# EAGLE design LMH6881-Breakout(Single_Layer) (EAGLE 7.7.0)
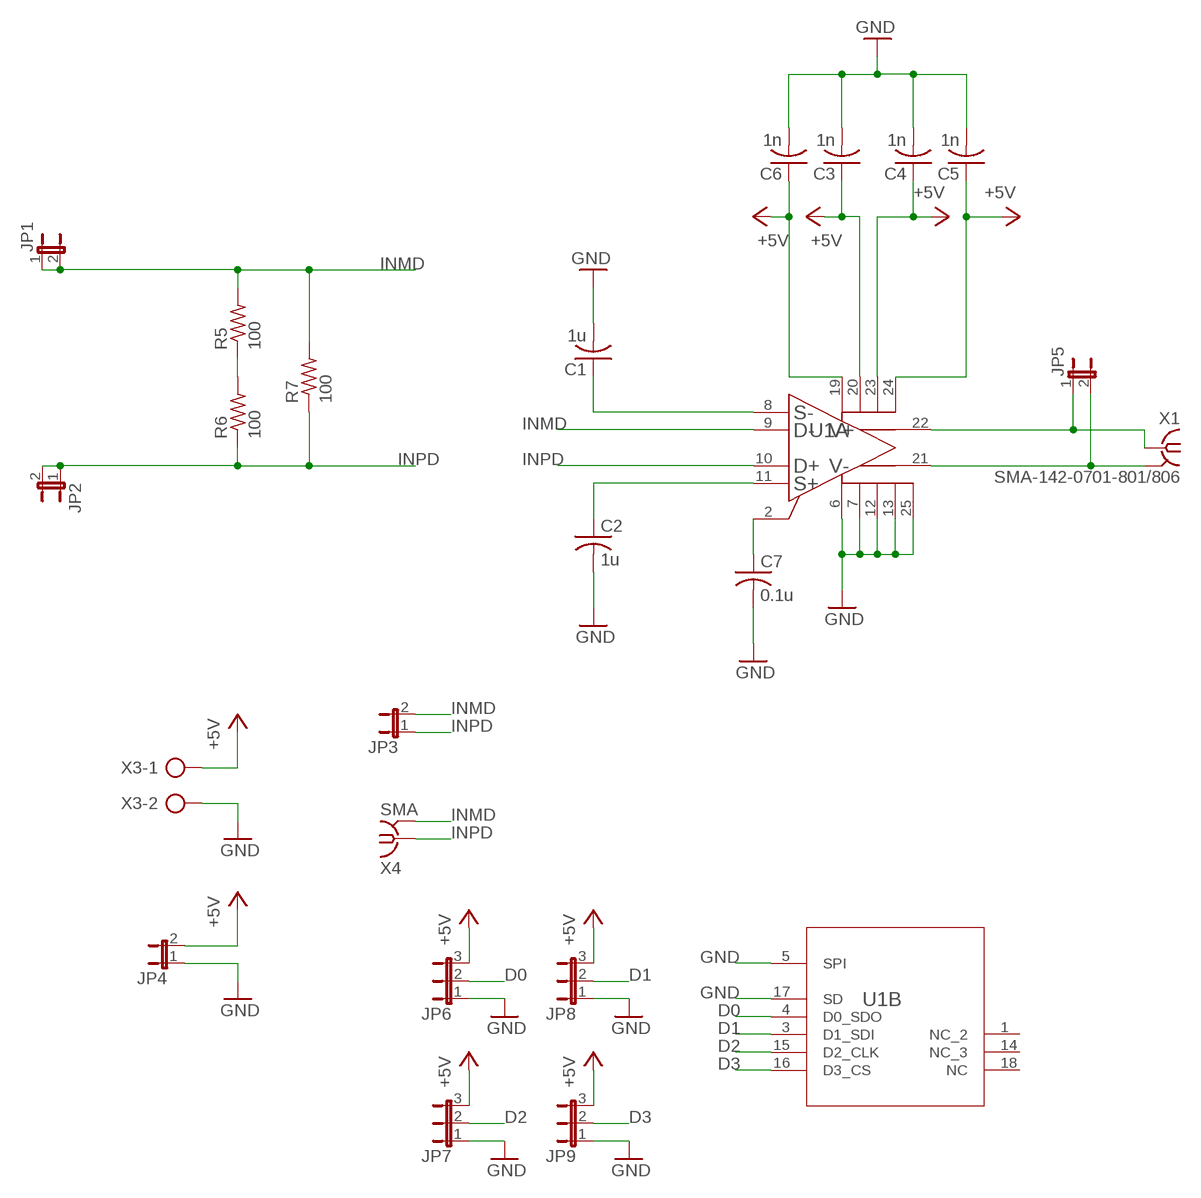
[diagram p0: schematic, sheet 1]

## Parts
C1  1u  C-USC0805  [C0805]
C2  1u  C-USC0805  [C0805]
C3  1n  C-USC0805  [C0805]
C4  1n  C-USC0805  [C0805]
C5  1n  C-USC0805  [C0805]
C6  1n  C-USC0805  [C0805]
C7  0.1u  C-USC0805  [C0805]
JP1  JP1E  [JP1]
JP2  JP1E  [JP1]
JP3  JP1E  [JP1]
JP4  JP1E  [JP1]
JP5  JP1E  [JP1]
JP6  JP2E  [JP2]
JP7  JP2E  [JP2]
JP8  JP2E  [JP2]
JP9  JP2E  [JP2]
R5  100  R-US_R0805  [R0805]
R6  100  R-US_R0805  [R0805]
R7  100  R-US_R0805  [R0805]
U1  LMH6881SQX/NOPB  [RTW0024A]
X1  SMA-142-0701-801/806  [J502-ND-142-0701-801/806]
X3  AK500/2  [AK500/2]
X4  SMA  SMA-142-0701-801/806  [J502-ND-142-0701-801/806]

## Nets
+5V: C3.1 C4.1 C5.1 C6.1 JP4.2 JP6.3 JP7.3 JP8.3 JP9.3 U1.19(A:VCC_2) U1.20(A:VCC_3) U1.23(A:VCC_4) U1.24(A:VCC) X3.1
D0: JP6.2 U1.4(B:D0_SDO)
D1: JP8.2 U1.3(B:D1_SDI)
D2: JP7.2 U1.15(B:D2_CLK)
D3: JP9.2 U1.16(B:D3_CS)
GND: C1.2 C2.2 C3.2 C4.2 C5.2 C6.2 C7.2 JP4.1 JP6.1 JP7.1 JP8.1 JP9.1 U1.5(B:SPI) U1.6(A:GND_2) U1.7(A:GND_3) U1.12(A:GND_4) U1.13(A:GND) U1.17(B:SD) U1.25(A:PAD) X3.2
INMD: JP1.1 JP1.2 JP3.2 R5.2 R7.2 U1.9(A:INMD) X4.G@1 X4.G@2 X4.G@3 X4.G@4
INPD: JP2.1 JP2.2 JP3.1 R6.1 R7.1 U1.10(A:INPD) X4.1
N$1: C7.1 U1.2(A:OCM)
N$3: C1.1 U1.8(A:INMS)
N$4: C2.1 U1.11(A:INPS)
N$5: JP5.1 U1.22(A:OUTP) X1.1
N$6: JP5.2 U1.21(A:OUTM) X1.G@1 X1.G@2 X1.G@3 X1.G@4
N$7: R5.1 R6.2
Unconnected: U1.1(B:NC_2) U1.14(B:NC_3) U1.18(B:NC)

## Library data of the parts
C1-C7 = resistor:C-US: CAPACITOR, American symbol
JP1-JP5 = jumper:JP1E: JUMPER
JP6-JP9 = jumper:JP2E: JUMPER
R5-R7 = resistor:R-US_: RESISTOR, American symbol
U1 = LMH6881:LMH6881SQX/NOPB; ALTERNATEPARTNUMBER: LMH6881SQNOPB; APPLICATION_BUILDNUMBER: *; COMPTYPE: IC; MANUFACTURER: Texas Instruments; MOUNTTYPE: SMT; PACKAGEREFERENCE: RTW0024A; PARTNUMBER: LMH6881SQXNOPB; PIN_COUNT: 25; REFDES: RefDes; ROHS: Y; TYPE: TYPE; VALUE: Value
X1 X4 = con-coax:SMA-: SMA 50 Ohm End Launch Jack Receptacle - Round Contact Johnson Components Source: www.johnsoncomponents.com .. J502-ND.pdf; MF: JOHNSON COMPONENTS; MPN: 142-0701-801; OC_FARNELL: 1608592; OC_NEWARK: 90F2624
X3 = con-ptr500:AK500/2: CONNECTOR; OC_FARNELL: unknown; OC_NEWARK: unknown

## Board
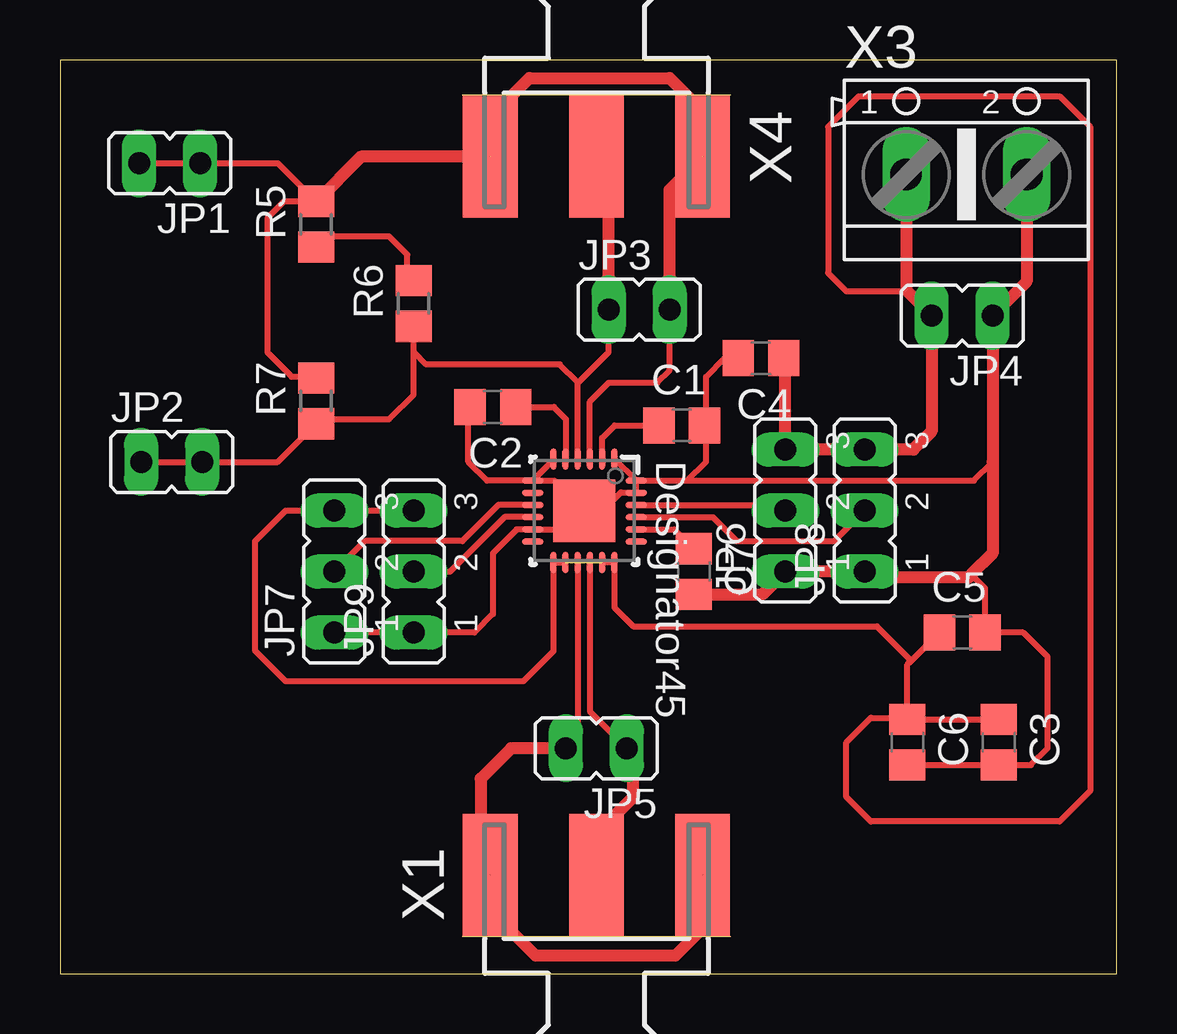
[diagram p1: board, top side]
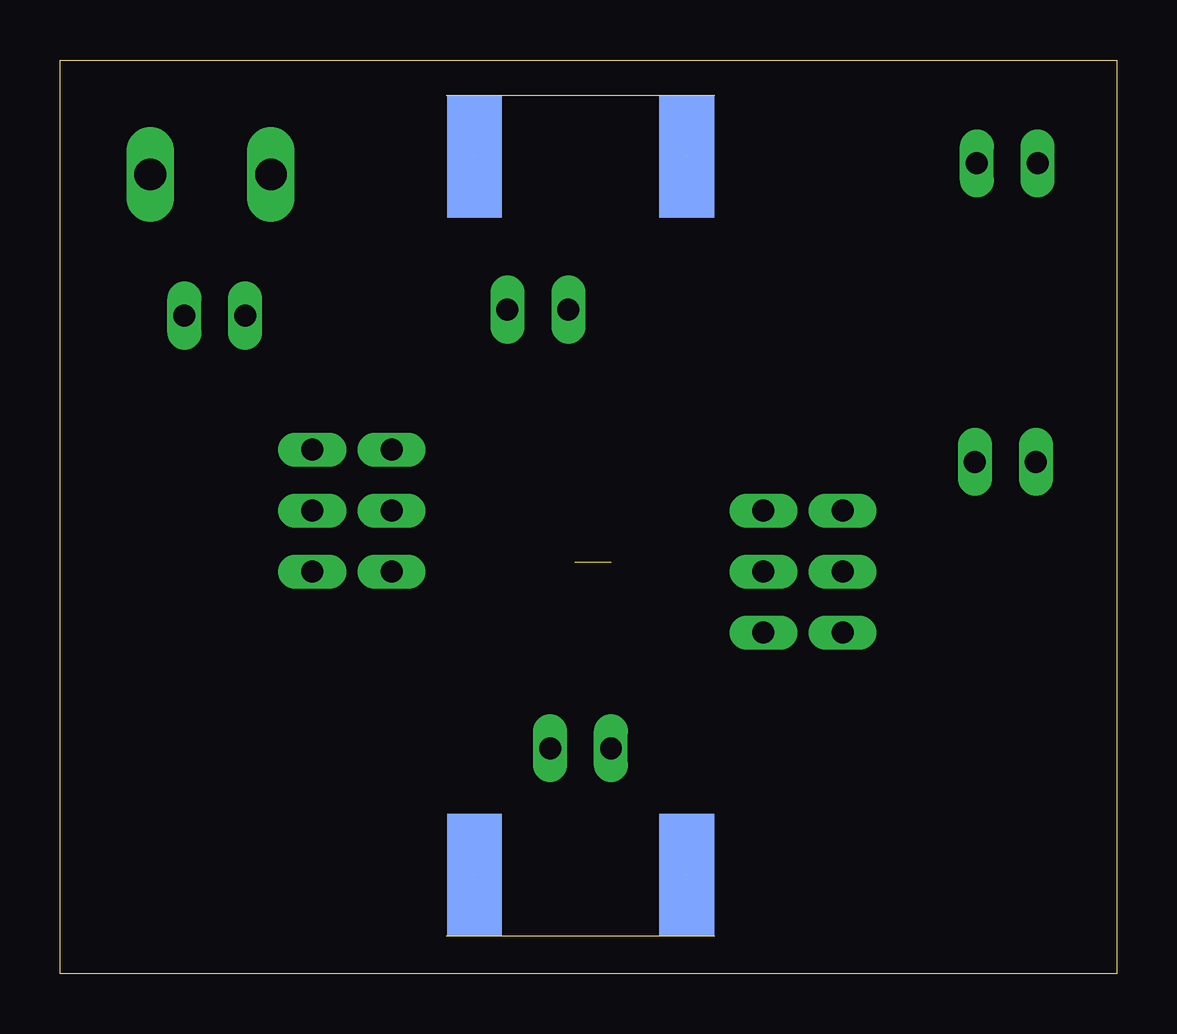
[diagram p2: board, bottom side, seen from below]

Size 44.04 x 38.09 mm. Coordinates in mm from the lower left corner, seen from the top.
Outline: 0,0 44.04,0 44.04,38.09 0,38.09 0,0
Copper layers (1*16): Top 0.035mm / dielectric 1.5mm / Bottom 0.035mm
Design rules "default": minimum track width 10mil, minimum drill 24mil, track to track 8mil, track to pad 8mil, pad to pad 8mil, via to via 8mil, smd to smd 8mil, copper to edge 40mil, drill to drill 8mil, minimum pad ring 10mil, minimum via ring 8mil, stop-mask expansion 4mil, vias tented up to drill 0mil, thermal gap 10mil

### Footprints (pad centres in the part's own frame; a part is rotated, then mirrored left to right if it is on the bottom)
C0805 = smd 1.3 x 1.5: 1 -0.95,0; 2 0.95,0
JP1 = drill 0.914 long: 1 0,-1.27; 2 0,1.27
JP2 = drill 0.914 long: 1 -2.54,0; 2 0,0; 3 2.54,0
R0805 = smd 1.3 x 1.5: 1 -0.95,0; 2 0.95,0
RTW0024A = smd 0.24 x 0.889: 1 1.29,2.164; 2 0.782,2.164; 3 0.274,2.164; 4 -0.234,2.164; 5 -0.742,2.164; 6 -1.25,2.164; 13 -1.25,-2.154; 14 -0.742,-2.154; 15 -0.234,-2.154; 16 0.274,-2.154; 17 0.782,-2.154; 18 1.29,-2.154 | smd 0.889 x 0.24: 7 -2.154,1.25; 8 -2.154,0.742; 9 -2.154,0.234; 10 -2.154,-0.274; 11 -2.154,-0.782; 12 -2.154,-1.29; 19 2.164,-1.29; 20 2.164,-0.782; 21 2.164,-0.274; 22 2.164,0.234; 23 2.164,0.742; 24 2.164,1.25 | smd 2.6 x 2.6: 25 0,0 | smd 0.5 x 0.5: V 0,1
J502-ND-142-0701-801/806 = smd 5.08 x 2.286: 1 2.565,0; G@1 2.565,4.42; G@2 2.565,-4.42 | smd 5.08 x 2.286 bottom: G@3 2.565,4.42; G@4 2.565,-4.42
AK500/2 = drill 1.321 long: 1 -2.515,0; 2 2.515,0

### Placement (x,y rotation side)
C1  25.91,22.86 0 top
C2  18.03,23.62 180 top
C3  39.12,9.65 270 top
C4  29.21,25.65 180 top
C5  37.59,14.22 0 top
C6  35.31,9.65 270 top
C7  26.42,16.76 270 top
JP1  4.57,33.78 90 top
JP2  4.65,21.34 270 top
JP3  24.13,27.69 270 top
JP4  37.59,27.43 90 top
JP5  22.35,9.4 90 top
JP6  30.23,19.3 90 top
JP7  11.43,16.76 90 top
JP8  33.53,19.3 90 top
JP9  14.73,16.76 90 top
R5  10.67,31.24 90 top
R6  14.73,27.94 90 top
R7  10.67,23.88 90 top
U1  21.84,19.3 270 top
X1  22.35,1.56 90 top
X3  37.77,33.31 0 top
X4  22.35,36.62 270 top

### Tracks (layer width: path | path; a pad name or v marks a point on that pad's centre or on a via)
+5V  (1 unrouted)
  Top 0.254: JP9.3 JP7.3 9.4,19.3 8.13,18.03 8.13,13.46 9.4,12.19 19.3,12.19 20.55,13.44 U1.19 | U1.19 20.55,14.5 | C6.1 35.31,12.89 35.47,13.05 | 35.47,13.05 C5.1 | C6.1 C3.1 | 35.47,13.05 34.04,14.48 23.88,14.48 23.09,15.26 U1.24 U1.23 | U1.19 U1.20 | C6.1 35.24,10.67 33.78,10.67 32.77,9.65 32.77,7.37 33.78,6.35 41.66,6.35 42.93,7.62 42.93,35.31 41.66,36.58 33.27,36.58 32,35.31 32,29.21 32.77,28.45 35.2,28.45 35.25,28.5 35.25,29.01
  Top 0.508: X3.1 35.25,28.5 JP4.2 36.32,22.61 35.56,21.84 JP8.3 JP6.3 30.23,25.59 C4.1
D0
  Top 0.254: U1.4 29.99,19.54 JP6.2
D1
  Top 0.254: U1.3 27.2,19.03 28.19,18.03 32.26,18.03 JP8.2
D2
  Top 0.254: U1.15 18.27,19.54 16.76,18.03 12.7,18.03 JP7.2
D3
  Top 0.254: JP9.2 16.26,16.76 18.54,19.05 19.67,19.05 U1.16
GND
  Top 0.254: U1.7 23.1,21.46 U1.6 | U1.12 20.55,21.42 U1.13 | U1.13 17.8,20.55 17.02,21.34 17.02,23.56 C2.2 | U1.6 U1.5 23.99,20.07 23.37,20.07 22.61,19.3 U1.25 | JP7.1 JP9.1 17.27,14.22 18.03,14.99 18.03,17.53 19.03,18.52 U1.17 21.06,18.52 U1.25 | U1.6 26.14,20.55 | 26.14,20.55 26.92,21.34 26.92,22.79 | 26.92,22.79 C1.2 | 26.92,22.79 26.92,24.89 27.69,25.65 C4.2 | C6.2 C3.2 40.45,8.7 41.15,9.4 41.15,13.21 40.13,14.22 C5.2 38.54,16.07 37.97,16.64 | 26.14,20.55 38.08,20.55 38.86,21.34 | U1.13 20.59,20.55 U1.25
  Top 0.508: X3.2 40.28,28.85 JP4.1 38.86,21.34 38.86,17.53 37.97,16.64 37.85,16.51 33.78,16.51 JP8.1 JP6.1 29.28,15.81 C7.2
INMD  (2 unrouted)
  Top 0.254: U1.9 22.08,23.86 22.86,24.64 24.89,24.64 25.4,25.15 JP3.2 | JP1.2 JP1.1 9.08,33.78 R5.2 9.33,32.19 8.64,31.5 8.64,25.91 9.65,24.89 10.6,24.89 R7.2
  Top 0.508: JP3.2 25.4,32.68 X4.G@3 26.42,34.41 26.42,36.32 25.4,37.34 19.56,37.34 17.93,35.71 X4.G@2 12.53,34.05 R5.2
INPD
  Top 0.254: U1.10 21.57,24.62 | 21.57,24.62 22.86,25.91 JP3.1 | JP2.1 JP2.2 9.08,21.34 R7.1 10.99,22.93 11.18,23.11 13.72,23.11 14.73,24.13 14.73,25.91 | 14.73,25.91 R6.1 | 21.57,24.62 21.57,24.66 20.83,25.4 15.24,25.4 14.73,25.91
  Top 0.508: JP3.1 22.86,33.54 X4.1
N$1
  Top 0.254: 23.88,18.54 23.9,18.52 U1.2 25.61,18.52 C7.1
N$3
  Top 0.254: U1.8 22.59,22.33 23.11,22.86 C1.1
N$4
  Top 0.254: C2.1 20.57,23.62 21.08,23.11 21.08,21.48 U1.11
N$5
  Top 0.254: U1.22 22.08,10.94 JP5.1
  Top 0.508: X1.1 22.35,5.84 23.88,7.37 23.88,9.14 JP5.1
N$6  (2 unrouted)
  Top 0.254: U1.21 21.57,9.89 JP5.2
  Top 0.508: X1.G@2 26.67,4.03 26.67,1.78 25.65,0.76 19.81,0.76 17.93,2.64 X1.G@3 17.53,4.54 17.53,8.13 18.8,9.4 JP5.2
N$7
  Top 0.254: R6.2 14.54,28.89 14.48,28.96 14.48,29.97 13.72,30.73 11.11,30.73 R5.1